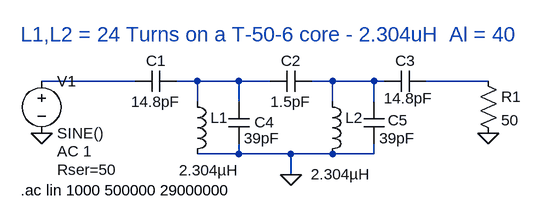
[diagram p0: schematic P3ST_20M_BPF.asc]
P3ST_20M_BPF.asc, the LTspice schematic file:
Version 4
SHEET 1 880 680
WIRE 32 160 -112 160
WIRE 128 160 96 160
WIRE 192 160 128 160
WIRE 240 160 192 160
WIRE 336 160 304 160
WIRE 400 160 336 160
WIRE 416 160 400 160
WIRE 576 160 480 160
WIRE 128 192 128 160
WIRE 192 192 192 160
WIRE 336 192 336 160
WIRE 400 192 400 160
WIRE 192 272 192 256
WIRE 192 272 128 272
WIRE 272 272 192 272
WIRE 336 272 272 272
WIRE 400 272 400 256
WIRE 400 272 336 272
WIRE 272 304 272 272
FLAG 576 240 0
FLAG -112 240 0
FLAG 272 304 0
SYMBOL cap 96 144 R90
WINDOW 0 0 32 VBottom 2
WINDOW 3 32 32 VTop 2
SYMATTR InstName C1
SYMATTR Value 14.8pF
SYMBOL cap 304 144 R90
WINDOW 0 0 32 VBottom 2
WINDOW 3 32 32 VTop 2
SYMATTR InstName C2
SYMATTR Value 1.5pF
SYMBOL cap 480 144 R90
WINDOW 0 0 32 VBottom 2
WINDOW 3 27 27 VTop 2
SYMATTR InstName C3
SYMATTR Value 14.8pF
SYMBOL res 560 144 R0
SYMATTR InstName R1
SYMATTR Value 50
SYMBOL voltage -112 144 R0
WINDOW 123 24 124 Left 2
WINDOW 39 24 152 Left 2
SYMATTR Value2 AC 1
SYMATTR SpiceLine Rser=50
SYMATTR InstName V1
SYMATTR Value SINE()
SYMBOL ind 112 176 R0
WINDOW 3 -12 121 Left 2
SYMATTR InstName L1
SYMATTR Value 2.304µH
SYMBOL ind 320 176 R0
WINDOW 3 -17 127 Left 2
SYMATTR InstName L2
SYMATTR Value 2.304µH
SYMBOL cap 176 192 R0
WINDOW 0 40 31 Left 2
SYMATTR InstName C4
SYMATTR Value 39pF
SYMBOL cap 384 192 R0
WINDOW 0 37 28 Left 2
SYMATTR InstName C5
SYMATTR Value 39pF
TEXT -144 328 Left 2 !.ac lin 1000 500000 29000000
TEXT -144 88 Left 3 ;L1,L2 = 24 Turns on a T-50-6 core - 2.304uH  Al = 40

The netlist it stands for:
* P3ST_20M_BPF.asc
C1 N002 N001 14.8pF
C2 N003 N002 1.5pF
C3 N004 N003 14.8pF
R1 N004 0 50
V1 N001 0 SINE() AC 1 Rser=50
L1 N002 0 2.304µH
L2 N003 0 2.304µH
C4 N002 0 39pF
C5 N003 0 39pF
.ac lin 1000 500000 29000000
* L1,L2 = 24 Turns on a T-50-6 core - 2.304uH  Al = 40
.backanno
.end